# Altium schematic sheet LMC555.SchDoc
size A
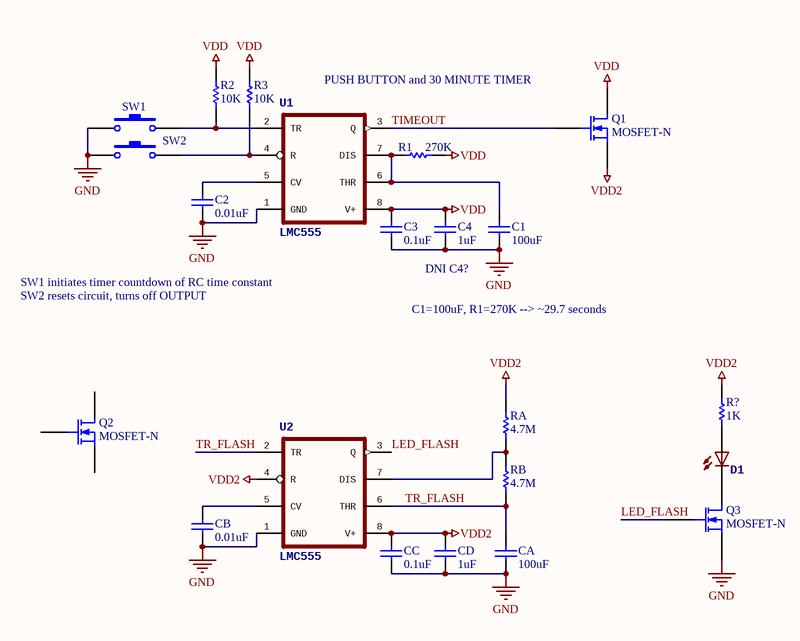
[diagram p0: LMC555.SchDoc]

## Parts
C1  value 100uF  [C1206]  (hidden comment: CAP)
C2  value 0.01uF  [0402]  (hidden comment: CAP)
C3  value 0.1uF  [0402]  (hidden comment: CAP)
C4  value 1uF  [0402]  (hidden comment: CAP)
CA  value 100uF  [C1206]  (hidden comment: CAP)
CB  value 0.01uF  [0402]  (hidden comment: CAP)
CC  value 0.1uF  [0402]  (hidden comment: CAP)
CD  value 1uF  [0402]  (hidden comment: CAP)
D1  LED   OSRAM: - CHIPLED LG R971, LG N971, LY N971, LG Q971, LY Q971, LO R971, LY R971 LH N974, LH R974 LS Q976, LO Q976, LY Q976 LO Q996 - Hyper CHIPLED LW Q18S LB Q993, LB Q99A, LB R99A - SideLED LS A670, LO A670, LY A670, LG A670, LP A670 LB A673, LV A673, LT A673, LW A673 LH A674 LY A675 LS A676, LA A676, LO A676, LY A676, LW A676 LS A679, LY A679, LG A679 -  Hyper Micro SIDELED® LS Y876, LA Y876, LO Y876, LY Y876 LT Y87S - SmartLED LW L88C, LW L88S LB L89C, LB L89S, LG L890 LS L89K, LO L89K, LY L89K LS L896, LA L896, LO L896, LY L896 - TOPLED LS T670, LO T670, LY T670, LG T670, LP T670 LSG T670, LSP T670, LSY T670, LOP T670, LYG T670 LG T671, LOG T671, LSG T671 LB T673, LV T673, LT T673, LW T673 LH T674 LS T676, LA T676, LO T676, LY T676, LB T676, LH T676, LSB T676, LW T676 LB T67C, LV T67C, LT T67C, LS T67K, LO T67K, LY T67K, LW E67C LS E67B, LA E67B, LO E67B, LY E67B, LB E67C, LV E67C, LT E67C LW T67C LS T679, LY T679, LG T679 LS T770, LO T770, LY T770, LG T770, LP T770 LB T773, LV T773, LT T773, LW T773 LH T774 LS E675, LA E675, LY E675, LS T675 LS T776, LA T776, LO T776, LY T776, LB T776 LHGB T686 LT T68C, LB T68C - Hyper Mini TOPLED® LB M676 - Mini TOPLED Santana® LG M470 LS M47K, LO M47K, LY M47K    Source: http://www.osram.convergy.de/  [CHIP-LED0603]  (value not drawn)
Q1  MOSFET-N  [E3]
Q2  MOSFET-N  [E3]
Q3  MOSFET-N  [E3]
R1  value 270K  [R0402]  (hidden comment: RES)
R2  value 10K  [R0402]  (hidden comment: RES)
R3  value 10K  [R0402]  (hidden comment: RES)
R?  value 1K  [R0402]  (hidden comment: RES)
RA  value 4.7M  [R0402]  (hidden comment: RES)
RB  value 4.7M  [R0402]  (hidden comment: RES)
SW1  SW-PB  [SPST-2]  (value not drawn)
SW2  SW-PB  [SPST-2]  (value not drawn)
U1  LMC555  [SO08]
U2  LMC555  [SO08]

## Nets
GND: C1.1 C2.1 C3.1 C4.1 CA.1 CB.1 CC.1 CD.1 Q3.3(S) SW1.1 SW2.1 U1.1(GND) U2.1(GND)
VDD: C3.2 C4.2 Q1.1(D) R1.1 R2.2 R3.2 U1.8(V+)
VDD2: CC.2 CD.2 Q1.3(S) R?.2 RA.1 U2.4(R) U2.8(V+)
LED_FLASH: Q3.2(G) U2.3(Q)
TIMEOUT: Q1.2(G) U1.3(Q)
TR_FLASH: CA.2 RB.2 U2.2(TR) U2.6(THR)
NetC1_2: C1.2 R1.2 U1.6(THR) U1.7(DIS)
NetC2_2: C2.2 U1.5(CV)
NetCB_2: CB.2 U2.5(CV)
NetD1_A: D1.A R?.1
NetD1_C: D1.C Q3.1(D)
NetR2_1: R2.1 SW1.2 U1.2(TR)
NetR3_1: R3.1 SW2.2 U1.4(R)
NetRA_2: RA.2 RB.1 U2.7(DIS)

Not connected (* = marked no-connect by the designer): Q2 1(D) 2(G) 3(S)

## Notes on the sheet
- (near U1) PUSH BUTTON and 30 MINUTE TIMER
- SW1 initiates timer countdown of RC time constant
- SW2 resets circuit, turns off OUTPUT
- C1=100uF, R1=270K --> ~29.7 seconds
- DNI C4?

## Library data of the parts
C1-C4 CA CB CC CD = CAP: Capacitor (Semiconductor SIM Model); Published: 8-Jun-2000; LatestRevisionDate: 29-May-2009; LatestRevisionNote: IPC-7351 Footprint Added.; PackageReference: C1206; Publisher: Altium Limited; PackageDescription: Chip Capacitor
D1 = LEDCHIP-LED0603
Q1-Q3 = MOSFET-N: N-Channel MOSFET; Published: 8-Jun-2000; LatestRevisionDate: 17-Jul-2002; LatestRevisionNote: Re-released for DXP Platform.; PackageVersion: 1995/1996; PackageReference: E3; Publisher: Altium Limited; PackageDescription: TO, Flat Index; 3 In-Line, Axial Leads; Body Dia. 4.6mm; Lead Dia. 0.5 mm (max)
R1-R3 R? RA RB = RES: Resistor; Published: 8-Jun-2000; LatestRevisionDate: 17-Jul-2002; LatestRevisionNote: Re-released for DXP Platform.; PackageReference: AXIAL-0.3; Publisher: Altium Limited; PackageDescription: Axial Device, Thru-Hole; 2 Leads; 0.3 in Pin Spacing
SW1 SW2 = SW-PB: Switch; Published: 24-Mar-1999; LatestRevisionDate: 17-Jul-2002; LatestRevisionNote: Re-released for DXP Platform.; PackageReference: SPST-2; Publisher: Altium Limited; PackageDescription: Switch; 2 Leads